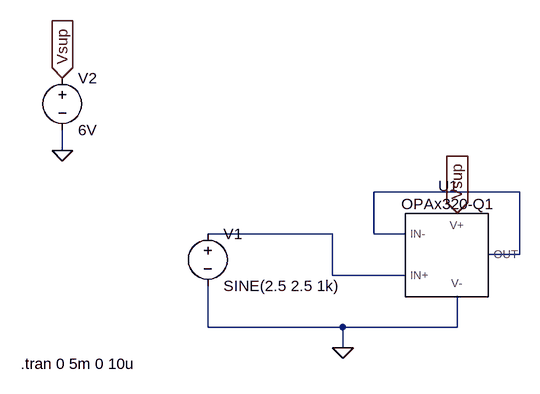
[diagram p0: schematic OPA320_Test.asc]
OPA320_Test.asc, the LTspice schematic file:
Version 4.1
SHEET 1 880 680
WIRE -128 -80 -128 -112
WIRE 576 -16 352 -16
WIRE 288 48 96 48
WIRE 352 48 352 -16
WIRE 400 48 352 48
WIRE 576 80 576 -16
WIRE 576 80 528 80
WIRE 288 112 288 48
WIRE 400 112 288 112
WIRE 96 192 96 128
WIRE 304 192 96 192
WIRE 480 192 480 144
WIRE 480 192 304 192
WIRE 304 224 304 192
FLAG -128 -192 Vsup
IOPIN -128 -192 In
FLAG 480 16 Vsup
IOPIN 480 16 In
FLAG 304 224 0
FLAG -128 -80 0
SYMBOL voltage 96 32 R0
WINDOW 123 0 0 Left 0
WINDOW 39 0 0 Left 0
SYMATTR InstName V1
SYMATTR Value SINE(2.5 2.5 1k)
SYMBOL OPAx320-Q1 464 80 R0
SYMATTR InstName U1
SYMBOL voltage -128 -208 R0
WINDOW 123 0 0 Left 0
WINDOW 39 0 0 Left 0
SYMATTR InstName V2
SYMATTR Value 6V
TEXT -192 248 Left 2 !.tran 0 5m 0 10u

The netlist it stands for:
* OPA320_Test.asc
V1 N002 0 SINE(2.5 2.5 1k)
X§U1 N002 N001 Vsup 0 N001 OPAx320-Q1  ; pins IN+ IN- V+ V- OUT
V2 Vsup 0 6V
.tran 0 5m 0 10u
.lib C:\Users\adnan\OneDrive\Documents\LTspice\MyLib\OPAx320-Q1.LIB
.backanno
.end